# Altium schematic sheet SPlitRail_DC-DC_Converter_SCH.SchDoc
size 431 x 279 mm; SheetNumber: 1; SheetTotal: 1
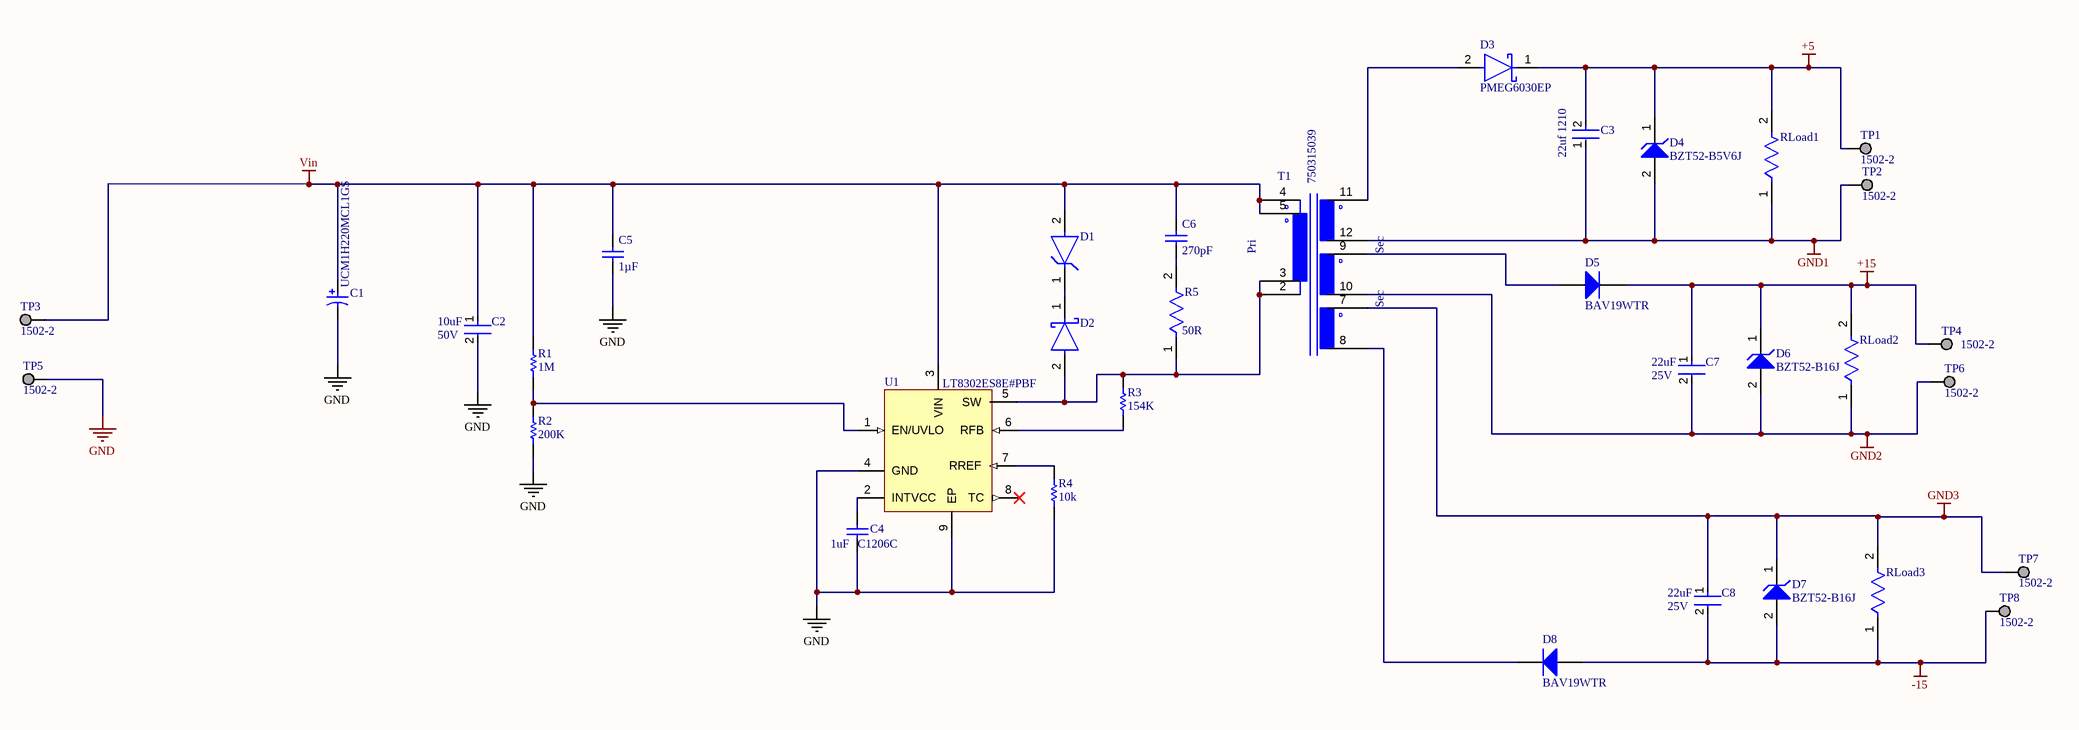
[diagram p0: SPlitRail_DC-DC_Converter_SCH.SchDoc]

## Parts
C1  UCM1H220MCL1GS  [PNSC-EEE-FK1H220P_L]
C2  value 50V  Capacitance: 10uF  [FP-GRM32-0_3-MFG]
C3  22uf 1210  [FP-EMK325A-M-MFG]
C4  Capacitance: 1uF  Series: C1206C  [CAPC3216X180X50ML20T25]  (hidden comment: C1206C105K3RACTU)
C5  Capacitance: 1µF  [CAPC1608X90X35ML10T25]  (hidden comment: UMK107BJ105KA-T)
C6  Capacitance: 270pF  [CAPC1608X90X35ML10T25]  (hidden comment: UMK107BJ105KA-T)
C7  value 25V  Capacitance: 22uF  [FP-GRM32-0_3-MFG]
C8  value 25V  Capacitance: 22uF  [FP-GRM32-0_3-MFG]
D1  SMAJ24A  [FP-SMAJ-MFG]  (value not drawn)
D2  PMEG10010ELRX  [FP-SOD123W-MFG]  (value not drawn)
D3  PMEG6030EP  [FP-SOD128-MFG]
D4  BZT52-B5V6J  [ONSC-SOD-123-2-425-04_V]
D5  BAV19WTR  [DIOD-SOD123-2_V]
D6  BZT52-B16J  [ONSC-SOD-123-2-425-04_V]
D7  BZT52-B16J  [ONSC-SOD-123-2-425-04_V]
D8  BAV19WTR  [DIOD-SOD123-2_V]
R1  1M  [RESC1608X55X30NL20T20]
R2  200K  [RESC1608X55X30NL20T20]
R3  154K  [RESC1608X55X30NL20T20]
R4  10k  [RESC1608X55X30NL20T20]
R5  Resistance: 50R  [FP-RN732B-IPC_B]  (hidden comment: RN732BTTD50R0B25)
RLoad1  RC1206JR-070RL  [FP-RC1206-MFG]  (value not drawn)
RLoad2  RC1206JR-070RL  [FP-RC1206-MFG]  (value not drawn)
RLoad3  RC1206JR-070RL  [FP-RC1206-MFG]  (value not drawn)
T1  750315039  [EFD20_SMT_H_12PIN_(5899)]
TP1  1502-2  [KSTN-1502-2]
TP2  1502-2  [KSTN-1502-2]
TP3  1502-2  [KSTN-1502-2]
TP4  1502-2  [KSTN-1502-2]
TP5  1502-2  [KSTN-1502-2]
TP6  1502-2  [KSTN-1502-2]
TP7  1502-2  [KSTN-1502-2]
TP8  1502-2  [KSTN-1502-2]
U1  LT8302ES8E#PBF  [LT-S8E-8_V]

## Nets
+5: C3.2 D3.1(C) D4.1(K) RLoad1.2 TP1.1
+15: C7.1 D5.2(K) D6.1(K) RLoad2.2 TP4.1
-15: C8.2 D7.2(A) D8.1(A) RLoad3.1 TP8.1
GND: C1.2 C2.2 C4.1 C5.1 R2.2 R4.2 TP5.1 U1.4(GND) U1.9(EP)
GND1: C3.1 D4.2(A) RLoad1.1 T1.12 TP2.1
GND2: C7.2 D6.2(A) RLoad2.1 T1.10 TP6.1
GND3: C8.1 D7.1(K) RLoad3.2 T1.7 TP7.1
Vin: C1.1 C2.1 C5.2 C6.2 D1.2(A) R1.1 T1.4 T1.5 TP3.1 U1.3(VIN)
NetC4_2: C4.2 U1.2(INTVCC)
NetC6_1: C6.1 R5.2
NetD1_1: D1.1(C) D2.1(K)
NetD2_2: D2.2(A) R3.1 R5.1 T1.2 T1.3 U1.5(SW)
NetD3_2: D3.2(A) T1.11
NetD5_1: D5.1(A) T1.9
NetD8_2: D8.2(K) T1.8
NetR1_2: R1.2 R2.1 U1.1(EN/UVLO)
NetR3_2: R3.2 U1.6(RFB)
NetR4_1: R4.1 U1.7(RREF)

Not connected (* = marked no-connect by the designer): U1 8(TC)*

## Notes on the sheet
- DWG. NO.
- REV.
- SHT.
- THIS DOCUMENT AND THE DATA DISCLOSED HEREIN OR HEREWITH IS THE PROPERTY OF ALTIUM LIMITED AND MAY BE FREELY DISTRIBUTED IN WHOLE. NO RIGHTS ARE RESERVED OR EXPRESS OR IMPLIED WARANTEE GIVEN.
- REVISION
- DESCRIPTION
- DATE
- APPROVED
- ENG:
- APPROVALS
- PROJECT
- DSN:
- CHK:
- REFERENCE DOCUMENTS
- PROJECT REVISION:
- TITLE
- DOCUMENT REVISION:
- DESIGN ITEM:
- BOM:
- FAB DWG:
- PCB DWG:
- ASSY DWG:
- SCALE:
- SIZE
- B
- CAGE CODE
- FILE NAME
- DWG NO.
- SHEET
- OF
- REV
- (in symbol 750315039) Pri; Sec

## Library data of the parts
C1 = CMP-2000-06209-1: Cap Aluminum Lytic, 22 uF, +/- 20%, 6.3 to 100 V, -55 to 105 degC, 2-Pin SMD, RoHS, Tape and Reel; Manufacturer: Panasonic; Capacitance: 22µF; Rated Voltage: 50V; Lifetime@Temperature: 2000Hrs@105°C; Ripple Current: 165mA; Impedance: 0.88O; Type: Can; Operating Temp Range: -55to+105°C; Package Reference: EEE-FK1H220P; Case Size/Dimension: Ø6.3x5.8mm; Manufacturer URL: http://www.panasonic.com/; Datasheet URL: http://www.mouser.com/ds/2/315/ABA0000CE120-68386.pdf; Mounting Technology: SurfaceMount; Datasheet Version: 03/2014; Package Description: 2-Pin Aluminum Electrolytic Capacitor, Base 6.6 x 6.6 mm, Height 6.10 mm; Operating Temp-Max: 105°C; Series: FK
C2 C7 C8 = CMP-2000-05259-2: CAP CER 10uF 50V  1210; 3DS Part Number: 220-00002; Manufacturer Part Number: GRM32ER60J107ME20L; Manufacturer: Murata; Voltage: 6.3V; Temperature Characteristic: X5R; Temperature Coefficient: 15%; Material: Ceramic; Tolerance: 20%; Octopart: https://octopart.com/grm32er60j107me20l-murata-197007; ComponentLink2URL: https://search.murata.co.jp/Ceramy/image/img/A01X/G101/ENG/GRM32ER60J107ME20-01.pdf; Temperature Range High: +85°C; RoHS: TRUE; Device Class L3: Ceramic Capacitors; Device Class L2: Capacitors; Package: GRM32-0.3; Voltage Rating: 6.3V; Category: Cap; Device Class L1: Passive Components; Automotive: No; Digikey Description: CAP CER 100UF 6.3V X5R 1210; Temperature: -55°C to +85°C; Height: 2.7mm; Ipc Land Pattern Name: CAPC320250X250; Temperature Range Low: -55°C; Lead Free: Yes; ComponentLink2Description: Datasheet
C3 = CMP-2000-05020-2: CAP CER 100UF 16V X5R 1210; Manufacturer Part Number: EMK325ABJ107MM-T; Manufacturer: Taiyo Yuden; Material: Ceramic; Temperature Coefficient: 15%; Tolerance: 20%; Description: CAPACITOR CERAMIC, 100UF, 16V, X5R, 20%, 1210; Ipc Land Pattern Name: CAPC320250X250; Package: EMK325A-M; Device Class L1: Passive Components; Height: 2.8mm; Device Class L2: Capacitors; Temperature Range Low: -55°C; RoHS: TRUE; Temperature Characteristic: X5R; Mouser Description: 1210 100 uF 16 V ±20% Tolerance X5R SMT Multilayer Ceramic Capacitor; ComponentLink2Description: Datasheet; Temperature: -55°C to +85°C; Device Class L3: Ceramic Capacitors; Capacitance: 100uF; Lead Free: Yes; Category: Cap; Octopart: https://octopart.com/emk325abj107mm-t-taiyo+yuden-20815747; Temperature Range High: +85°C; Automotive: No; Value: 100uF; Digikey Description: CAP CER 100UF 16V X5R 1210; Voltage Rating: 16V; ComponentLink2URL: https://www.yuden.co.jp/productdata/catalog/mlcc01_e.pdf
C4 = CMP-2000-04991-1: Chip Capacitor, 1 uF, +/- 10%, 25 V, -55 to 125 degC, 1206 (3216 Metric), RoHS, Tape and Reel; Manufacturer: Kemet; Temperature Coefficient / Code: +/-15%; Dielectric: X7R; Voltage Rating DC: 25V; Capacitance - nF: 1000nF; Class: Class1; Case Length: 3.2mm; Type: SMDMLCCX7R6.3-250VDCCommericalGrade; Case Width: 1.6mm; Product: GeneralTypeMLCCs; Datasheet URL: https://ciiva.com/datasheet-click-18194173?src=ciiva&sig=6daff8c4; Operating Temperature Range: -55Cto+125C; RoHS: Details; Product Category: MultilayerCeramicCapacitorsMLCC-SMD/SMT; Manufacturer URL: http://www.kemet.com/; Minimum Operating Temperature: -55C; Dimensions: 1.6mmWx3.2mmLx1.6mmH; Termination Style: SMD/SMT; Brand: Kemet; Packaging: Reel; Package / Case: 1206(3216metric); Case Code - mm: 3216; Datasheet Version: Jul-14; Factory Pack Quantity: 2000; Package Description: 2-Pin Surface Mount Device, Body 3.2 x 1.6 mm; Tolerance: 10%; Package Reference: 1206; Case Height: 1.6mm; Case Code - in: 1206; Maximum Operating Temperature: +125C; Voltage Rating: 25V
C5 C6 = CMP-2000-05447-1: Chip Capacitor, 1 uF, +/- 10%, 50 V, -55 to 85 degC, 0603 (1608 Metric), RoHS, Tape and Reel; Manufacturer: Taiyo Yuden; Other Names: 587-2400-6; Temperature Coefficient: X5R; Online Catalog: MSeries; Catalog Drawings: xMKSeries_0603_0.8; Voltage - Rated: 50V; Series: M; Standard Package: 1; Package Description: 2-Pin Surface Mount Device, Body 1.6 x 0.8 mm; Ratings: -; Height - Seated (Max): -; Mounting Type: SurfaceMount,MLCC; Family: CeramicCapacitors; Size / Dimension: 0.063"Lx0.031"W(1.60mmx0.80mm); Features: -; Applications: GeneralPurpose; Lead Spacing: -; Packaging: Digi-Reel; Package Reference: 603; Thickness (Max): 0.035"(0.90mm); Category: Capacitors; Operating Temperature: -55degC~85degC; Datasheet URL: https://datasheet.ciiva.com/15922/336umk107bj105ka-t-15922611.pdf; Package / Case: 0603(1608Metric); Manufacturer URL: http://www.t-yuden.com/; Lead Style: -; Tolerance: ±10%; Datasheet Version: Mar-13
D1 = CMP-08607-000085-1: TVS DIODE 24V 38.9V DO214AC; Manufacturer: Littelfuse Inc; Direction: Unidirectional; Peak Pulse Power: 400W; Peak Pulse Current: 10.3A; Max Junction Temp: +150°C; Breakdown Voltage: 26.7V; Number Of Channels: 1; ComponentLink2Description: Datasheet; Device Class L3: unset; Height: 2.29mm; ComponentLink2URL: https://www.littelfuse.com/~/media/electronics/datasheets/tvs_diodes/littelfuse_tvs_diode_smaj_datasheet.pdf.pdf; Device Class L1: Circuit Protection; Package: SMAJ; Temperature Range High: +150°C; Device Class L2: TVS Diodes; Clamping Voltage: 38.9V; Reverse Standoff Voltage: 24V; Manufacturer Part Number: SMAJ24A; Mouser Description: In a Pack of 25, Littelfuse SMAJ24A, Uni-Directional TVS Diode, 400W, 2-Pin DO-214AC; Digikey Description: TVS DIODE 24V 38.9V DO214AC; Lead Free: Yes; Octopart: https://octopart.com/smaj24a-littelfuse-350003; Automotive: No; Temperature Range Low: -65°C; Category: Diode; RoHS: TRUE; Temperature: -65°C to +150°C
D2 = CMP-14398-000004-1: DIODE SCHOTTKY 30V 1A SOD123W; Manufacturer: Nexperia; Manufacturer Part Number: PMEG3010BER,115; Automotive Grade: Grade 0; Max Surge Forward Current: 50A; Peak Reverse Current: 15uA; Max Junction Temp: +150°C; Capacitance: 170pF; Value: 170pF; ComponentLink2URL: https://assets.nexperia.com/documents/data-sheet/PMEG3010BER.pdf; Reverse Voltage: 30V; Forward Current: 1A; Ambient Temperature Range Low: -55°C; Ambient Temperature Range High: +150°C; Octopart: https://octopart.com/pmeg3010ber%2C115-nexperia-78741454; Package: SOD123W; Category: Diode; Lead Free: Yes; Digikey Description: DIODE SCHOTTKY 30V 1A SOD123W; Automotive: Yes; RoHS: TRUE; Height: 1.1mm; Temperature: to +150°C; Device Class L2: Diodes; ComponentLink2Description: Datasheet; Temperature Range High: +150°C; Device Class L3: Schottky Diodes; Device Class L1: Discrete Semiconductors; Footprint Url: https://assets.nexperia.com/documents/outline-drawing/SOD123W.pdf
D3 = CMP-14398-000017-1: PMEG60T50ELP/SOD128/FLATPOWER
D4 D6 D7 = CMP-1060-00514-1: Zener Voltage Regulator, 500 mW, 2-Pin SOD-123, Pb-Free, Tape and Reel; Manufacturer: On Semiconductor; PartNumber: SZMMSZ3V3T1G; P Max (W): 0.5; ComponentLink2Description: Datasheet; ComponentLink1Description: Manufacturer URL; PackageDescription: 2-Pin SOD, Body 1.6 x 2.69 mm; ComponentLink3Description: Package Specification; ComponentLink3URL: http://www.onsemi.com/pub_link/Collateral/425-04.PDF; ComponentLink1URL: http://www.onsemi.com/; ComponentLink2URL: http://www.onsemi.com/pub_link/Collateral/MMSZ2V4T1-D.PDF; PackageVersion: Rev. G, 10/2009; RoHS: Pb-Free; DatasheetVersion: Rev. 11; Mounting Technology: Surface Mount; PackageReference: SOD-123-2-425-04; Packing: Tape and Reel
D5 D8 = CMP-2000-04932-2: Fast Switching Diode, 100 V, 0.15 A, -65 to 150 degC, 2-Pin?SOD123, RoHS, Tape and Reel; Recovery Time: 4ns; Brand: DiodesIncorporated; Unit Weight: 0.000353oz; Max Surge Current: 2A; Peak Reverse Voltage: 100V; Ir - Reverse Current: 1uA; Vf - Forward Voltage: 1.25V; Configuration: Single; If - Forward Current: 0.15A; Product Category: Diodes-GeneralPurpose,Power,Switching; Operating Temperature Range: -65Cto+150C; Packaging: Reel; Manufacturer URL: http://www.diodes.com/; Maximum Operating Temperature: +150C; Height: 1.25mm; Minimum Operating Temperature: -65C; Product: SwitchingDiodes; Package URL: http://www.diodes.com/datasheets/ds18004.pdf; Type: SwitchingDiode; Package Reference: SOD123-2; Width: 1.7mm; Datasheet URL: http://www.farnell.com/datasheets/1915529.pdf; Datasheet Version: Rev. 24-2, 10/2013; Series: 1N4148; Factory Pack Quantity: 3000; Length: 2.85mm; RoHS: True; Manufacturer: DiodesIncorporated; Mounting Style: SMD/SMT; Package / Case: SOD-123
R1-R4 = CMP-2000-00882-1: Manufacturer: Panasonic; Part Number: ERA3AEB112V
R5 = CMP-04015-000187-1: 50Ω ±0.1% 0.125W, 1/8W Chip Resistor 1206 (3216 Metric) Moisture Resistant Thin Film; Power Rating: 125mW; Voltage Rating: 150V; Temperature Coefficient: 25ppm/°C; Case/Package: 1206; Packaging: Tape and Reel; Tolerance: 0.1%; Max Operating Temperature: 125°C; Height: 0.6mm; Length: 3.2mm; Width: 1.6mm; Min Operating Temperature: -55°C; Case Code (Metric): 3216; Package Quantity: 5000; Termination: SMD/SMT; Case Code (Imperial): 1206; Composition: Thin Film
RLoad1-RLoad3 = CMP-2100-03681-2: RES SMD 0 OHM JUMPER 1/4W 1206; Manufacturer: YAGEO; Voltage Rating: 200V; Temperature Coefficient: 300ppm/°C; Power Rating: 0.25W; Value: 0Ω; Tolerance: 5%; Manufacturer Part Number: RC1206JR-070RL; Temperature Range Low: -55°C; Category: Res; Automotive: No; Ipc Land Pattern Name: RESC310160X55; Device Class L1: Passive Components; Temperature: -55°C to +155°C; ComponentLink2URL: https://www.yageo.com/upload/media/product/productsearch/datasheet/rchip/PYu-RC_Group_51_RoHS_L_10.pdf; Lead Free: Yes; Height: 0.65mm; Footprint Url: https://www.yageo.com/upload/website/yageo_PYu-R_Mount_10_19050818_343.pdf; Package: RC1206; Digikey Description: RES SMD 0 OHM JUMPER 1/4W 1206; Temperature Range High: +155°C; Device Class L3: Chip SMD Resistors; Device Class L2: Resistors; Octopart: https://octopart.com/rc1206jr-070rl-yageo-40025601; Resistance: 0Ω; Series: RC; ComponentLink2Description: Datasheet; Composition: Thick Film; RoHS: TRUE; Mouser Description: Resistor: thick film; SMD; 1206; 0O; 0.25W; ±5%; -55÷155°C
T1 = 750315039: Isolated Buck Converters For For DC/DC Converters SMPS Transformer 1500Vrms Isolation 250kHz Surface Mount; MF: WÃ¼rth Elektronik; Check_prices: https://www.snapeda.com/parts/750315039/W%C3%BCrth%20Elektronik/view-part/4792337/?ref=eda; MP: 750315039; Package: WÃ¼rth Elektronik; Price: None; Availability: In Stock; Purchase-URL: https://pricing.snapeda.com/search/part/750315039/?ref=eda; SnapEDA_Link: https://www.snapeda.com/parts/750315039/W%C3%BCrth%20Elektronik/view-part/4792337/?ref=snap; Value: *
TP1-TP8 = CMP-1672-00001-5: Terminal DBL Turret, Through Hole, RoHS; Manufacturer: Keystone; ComponentLink1URL: http://www.keyelco.com/; ComponentLink2Description: Datasheet; Length: 2.77 mm; Mount: Through Hole; PackageDescription: 1-Pin Through Hole Device, Dia 3.18 mm; Lead Pitch: 0.218 inch; DatasheetVersion: Rev. A, 02/2008; PackageReference: 1502-2; ComponentLink2URL: http://www.keyelco.com/product-pdf.cfm?p=3293; ComponentLink1Description: Manufacturer URL; Mounting Technology: Through Hole; Package Quantity: 1; Pins: 50; REACH SVHC: No SVHC; Contact Finish: Tin; Contact Material: Brass; RoHSCompliant: true
U1 = CMP-0492-02713-1: Micropower No-Opto Isolated Flyback Converter, 2.8 to 42 V, -40 to 125 degC, 8-Pin SOIC (S8E), RoHS, Tube; PartNumber: LT8302; Number of Outputs: 1; VIN Min: 2.8 V; Output Current: 3.6 A; VIN Max: 42 V; RoHS: TRUE; ComponentLink1Description: Manufacturer URL; ComponentLink2Description: Datasheet; DatasheetVersion: Rev. A; Temperature Min: -40 degC; ComponentLink3Description: Package Specification; ComponentLink3URL: http://cds.linear.com/docs/en/packaging/05081857_A_S8E.pdf; PackageDescription: 8-Pin Plastic Small Outline Integrated Circuit Package, Body 4.90 x 3.90 mm, Pitch 1.27 mm; Packing: Tube; ComponentLink1URL: http://www.linear.com/; Temperature Max: 125 degC; ComponentLink2URL: http://cds.linear.com/docs/en/datasheet/8302fa.pdf; PackageVersion: Rev. A, 10/2013; Mounting Technology: Surface Mount